# Altium schematic sheet PowerConverters.SchDoc
size A3; SheetNumber: 3; SheetTotal: 3
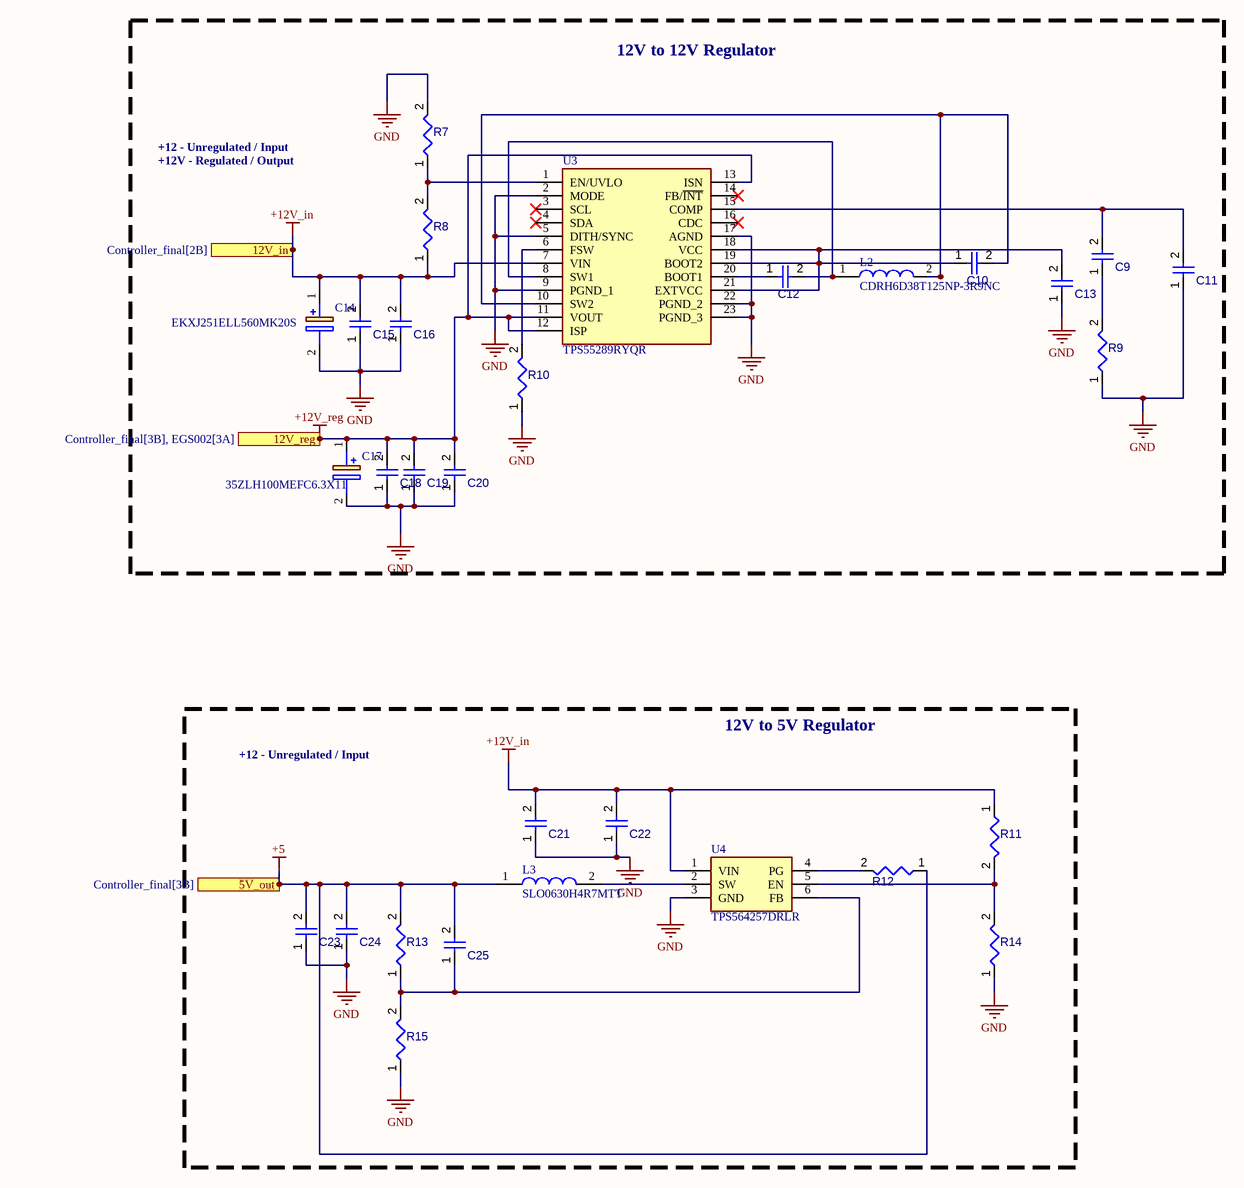
[diagram p0: PowerConverters.SchDoc]

## Parts
C9  Capacitor 1nF +/-20% 50V 0402  [CAPC0402(1005)33_L]  (value not drawn)
C10  Capacitor 100 nF +/-10% 50 V 0603  [CAPC1608X90X40NL10T20]  (value not drawn)
C11  Capacitor 1 uF +/- 10% 25 V 0805  [CAPC2013X145X50ML20T25]  (value not drawn)
C12  Capacitor 100 nF +/-10% 50 V 0603  [CAPC1608X90X40NL10T20]  (value not drawn)
C13  Capacitor 4.7µF +/-40% 25V 0805  [CAPC0805(2012)145_L]  (value not drawn)
C14  EKXJ251ELL560MK20S  [CAPPRD500W60D1275H2000 - duplicate]
C15  Capacitor 22µF +/-40% 16V 0805  [CAPC0805(2012)145_L]  (value not drawn)
C16  Capacitor 1µF +/-40% 50V 0603  [CAPC0603(1608)100_L]  (value not drawn)
C17  35ZLH100MEFC6.3X11  [CAPPRD250W50D680H1250]
C18  Capacitor 22µF +/-40% 16V 0805  [CAPC0805(2012)145_L]  (value not drawn)
C19  Capacitor 22µF +/-40% 16V 0805  [CAPC0805(2012)145_L]  (value not drawn)
C20  Capacitor 1µF +/-40% 50V 0603  [CAPC0603(1608)100_L]  (value not drawn)
C21  Capacitor 22µF +/-40% 16V 0805  [CAPC0805(2012)145_L]  (value not drawn)
C22  Capacitor 100 nF +/-10% 50 V 0603  [CAPC1608X90X40NL10T20]  (value not drawn)
C23  Capacitor 22µF +/-40% 16V 0805  [CAPC0805(2012)145_L]  (value not drawn)
C24  Capacitor 100 nF +/-10% 50 V 0603  [CAPC1608X90X40NL10T20]  (value not drawn)
C25  Capacitor 10 pF +/- 0.25 pF 50 V 0603  [CAPC1608X87X35NL15T15]  (value not drawn)
L2  CDRH6D38T125NP-3R9NC  [CDRH6D18HPNP101PC]
L3  SLO0630H4R7MTT  [INDPM7166X300N]
R7  Resistor 100k +/-1% 1206 250 mW  [RESC3216X60X45ML15T20]  (value not drawn)
R8  Resistor 100k +/-1% 0603 100 mW  [RESC1608X55X25ML10T15]  (value not drawn)
R9  Resistor 100k +/-1% 0603 100 mW  [RESC1608X55X25ML10T15]  (value not drawn)
R10  Resistor 100k +/-1% 1206 250 mW  [RESC3216X60X45ML15T20]  (value not drawn)
R11  210 kOhms 0805  [RESC0805(2012)_L]  (value not drawn)
R12  Resistor 10k +/-1% 0805 125 mW  [RESC2013X50X35ML15T15]  (value not drawn)
R13  Resistor 125mW 220kΩ 0805  [RESC2013X70X40ML20T20]  (value not drawn)
R14  Resistor 30k +/-1% 0805 125 mW  [RESC2013X50X35ML15T15]  (value not drawn)
R15  Resistor 30k +/-1% 0805 125 mW  [RESC2013X50X35ML15T15]  (value not drawn)
U3  TPS55289RYQR  [TPS55289RYQR]
U4  TPS564257DRLR  [SOTFL50P160X60-6N]

## Blocks framed on the sheet
12V to 12V Regulator: C9-C20 L2 R7-R10 U3
12V to 5V Regulator: C21-C25 L3 R11-R15 U4

## Ports
5V_out (see Controller_final[3B]), 12V_in (see Controller_final[2B]), 12V_reg (see Controller_final[3B], EGS002[3A])

## Nets
+5: C23.2 C24.2 C25.2 L3.1 R12.1 R13.2 ; port 5V_out
+12V_in: C14.1(+) C15.2 C16.2 C21.2 C22.2 R8.1 R11.1 U3.7(VIN) U4.1(VIN) ; port 12V_in
+12V_reg: C17.1(+) C18.2 C19.2 C20.2 U3.11(VOUT) U3.12(ISP) U3.13(ISN) ; port 12V_reg
GND: C11.1 C13.1 C14.2(-) C15.1 C16.1 C17.2(-) C18.1 C19.1 C20.1 C21.1 C22.1 C23.1 C24.1 R7.2 R9.1 R10.1 R14.1 R15.1 U3.2(MODE) U3.5(DITH/SYNC) U3.9(PGND_1) U3.17(AGND) U3.22(PGND_2) U3.23(PGND_3) U4.3(GND)
NetC9_1: C9.1 R9.2
NetC9_2: C9.2 C11.2 U3.15(COMP)
NetC10_1: C10.1 C13.2 U3.18(VCC) U3.19(BOOT2) U3.21(EXTVCC)
NetC10_2: C10.2 L2.2 U3.10(SW2)
NetC12_1: C12.1 U3.20(BOOT1)
NetC12_2: C12.2 L2.1 U3.8(SW1)
NetC25_1: C25.1 R13.1 R15.2 U4.6(FB)
NetL3_2: L3.2 U4.2(SW)
NetR7_1: R7.1 R8.2 U3.1(EN/UVLO)
NetR10_2: R10.2 U3.6(FSW)
NetR11_2: R11.2 R14.2 U4.5(EN)
NetR12_2: R12.2 U4.4(PG)

Not connected (* = marked no-connect by the designer): U3 3(SCL)* 4(SDA)* 14(FB/~{INT})* 16(CDC)*

## Notes on the sheet
- +12 - Unregulated / Input
- +12V - Regulated / Output

## Library data of the parts
C9 = CMP-001-00066-3: Chip Capacitor, 1nF +/-20%, 50V, 0402, Thickness 0.33 mm; Tolerance: 10%; Mounting Technology: SMT; Case/Package: 0402; Pins: 2; Min Operating Temperature: -55°C; Max Operating Temperature: 85°C; Voltage Rating: 50V; Value: 1nF
C10 C12 C22 C24 = CMP-001-00017-6: Chip Capacitor, 100 nF, +/- 10%, 50 V, 0603 (1608 Metric); Capacitor Type: Ceramic; Voltage Rating: 50V; Value: 100nF; Mounting Technology: SM; Case/Package: 0603; Pins: 2; RoHS Compliant: True; Min Operating Temperature: -55°C; Max Operating Temperature: 125°C; Tolerance: 10%
C11 = CMP-001-00010-6: Chip Capacitor, 5.1pF, +/-10%, 250 V, 0805 (2012 Metric); Capacitor Type: Ceramic; Voltage Rating: 25V; Value: 1µF; Mounting Technology: SM; Case/Package: 0805; Pins: 2; RoHS Compliant: True; Min Operating Temperature: -55°C; Max Operating Temperature: 125°C; Tolerance: 10%
C13 = CMP-001-00080-4: Chip Capacitor, 4.7µF +/-40%, 25V, 0805, Thickness 1.45 mm; Tolerance: 20%; Mounting Technology: SMT; Case/Package: 0805; Pins: 2; Min Operating Temperature: -55°C; Max Operating Temperature: 85°C; Voltage Rating: 25V; Value: 4.7µF
C14 = UPW0J222MHD: 56uF 250V Aluminum Electrolytic Capacitors Through Hole,D12.5xL20mm 10000hrs@105℃; Manufacturer_Name: Nichicon; Datasheet Link: https://componentsearchengine.com/Datasheets/1/UPW0J222MHD.pdf; Height: 20mm; Manufacturer_Part_Number: UPW0J222MHD; Mouser Part Number: 647-UPW0J222MHD; Mouser Price/Stock: https://www.mouser.co.uk/ProductDetail/Nichicon/UPW0J222MHD?qs=xKlMw8j03VdQkAIq%2FPYnUg%3D%3D
C15 C18 C19 C21 C23 = CMP-001-00081-4: Chip Capacitor, 22µF +/-20%, 25V, 0805, Thickness 1.45 mm X5R; Tolerance: 5%; Mounting Technology: SMT; Case/Package: 0805; Pins: 2; Min Operating Temperature: -55°C; Max Operating Temperature: 85°C; Voltage Rating: 16V; Value: 22µF
C16 C20 = CMP-001-00078-4: Chip Capacitor, 1µF +/-40%, 50V, 0603, Thickness 1 mm; Tolerance: 10%; Mounting Technology: SMT; Case/Package: 0603; Pins: 2; Min Operating Temperature: -55°C; Max Operating Temperature: 85°C; Voltage Rating: 50V; Value: 1µF
C17 = MAL203856101E3: 100uF 35V Aluminum Electrolytic Capacitors Through Hole,D6.3xL11mm 6000hrs@105℃; Manufacturer_Name: Vishay; Datasheet Link: https://componentsearchengine.com/Datasheets/2/MAL203856101E3.pdf; Height: 12.5mm; Manufacturer_Part_Number: MAL203856101E3; Mouser Part Number: 594-MAL203856101E3; Mouser Price/Stock: https://www.mouser.co.uk/ProductDetail/Vishay-BC-Components/MAL203856101E3?qs=G99oyVYclWUG3wiHKtPKfA%3D%3D; Arrow Part Number: MAL203856101E3; Arrow Price/Stock: https://www.arrow.com/en/products/mal203856101e3/vishay
C25 = CMP-001-00012-6: Chip Capacitor, 10 pF, +/- 0.25 pF, 50 V, 0603 (1608 Metric); Capacitor Type: Ceramic; Voltage Rating: 50V; Tolerance: 0.25%; Value: 10pF; Mounting Technology: SM; Case/Package: 0603; Pins: 2; RoHS Compliant: True; Min Operating Temperature: -55°C; Max Operating Temperature: 125°C
L2 = CDRH6D18HPNP-101PC: Inductor 3.9uH ,19.6mOhm, SMD, 6.7mm X 6.7mm; Manufacturer_Name: Sumida; Datasheet Link: https://4donline.ihs.com/images/VipMasterIC/IC/SMDC/SMDC-S-A0002849326/SMDC-S-A0002849326-1.pdf?hkey=EF798316E3902B6ED9A73243A3159BB0; Height: 2mm; Manufacturer_Part_Number: CDRH6D18HPNP-101PC
L3 = SRP6530A-R47M: 5.5A 4.7uH ±20% 9A 38mΩ Magnetic Shielded Inductor SMD,7.1x6.6mm Fixed Inductors RoHS; Manufacturer_Name: Bourns; Datasheet Link: http://www.bourns.com/docs/Product-Datasheets/SRP6530A.pdf; Height: 3mm; Manufacturer_Part_Number: SRP6530A-R47M; Mouser Part Number: 652-SRP6530A-R47M; Mouser Price/Stock: https://www.mouser.co.uk/ProductDetail/Bourns/SRP6530A-R47M?qs=e8oIoAS2J1QHe7BXX3%252BHFQ%3D%3D; Arrow Part Number: SRP6530A-R47M; Arrow Price/Stock: https://www.arrow.com/en/products/srp6530a-r47m/bourns?region=nac
R7 = CMP-009-00025-5: Chip Resistor, 100 KOhm, +/- 1%, 0.25 W, -55 to 155 degC, 1206 (3216 Metric); Power: 250mW; Voltage Rating: 200V; Mounting Technology: SM; Case/Package: 1206; Pins: 2; RoHS Compliant: True; Min Operating Temperature: -55°C; Max Operating Temperature: 155°C; Tolerance: 1%; Value: 100k
R8 = CMP-009-00023-5: Chip Resistor, 715 KOhm, +/- 1%, 0.1 W, -55 to 155 degC, 0603 (1608 Metric); Power: 100mW; Voltage Rating: 50V; Mounting Technology: SM; Case/Package: 0603; Pins: 2; RoHS Compliant: True; Min Operating Temperature: -55°C; Max Operating Temperature: 155°C; Tolerance: 1%; Value: 100k
R9 = CMP-009-00023-5: Chip Resistor, 105 KOhm, +/- 1%, 0.1 W, -55 to 155 degC, 0603 (1608 Metric); Power: 100mW; Voltage Rating: 50V; Mounting Technology: SM; Case/Package: 0603; Pins: 2; RoHS Compliant: True; Min Operating Temperature: -55°C; Max Operating Temperature: 155°C; Tolerance: 1%; Value: 100k
R10 = CMP-009-00025-5: Chip Resistor, 48.7 KOhm, +/- 1%, 0.25 W, -55 to 155 degC, 200V, 1206 (3216 Metric); Power: 250mW; Mounting Technology: SM; Case/Package: 1206; Pins: 2; RoHS Compliant: True; Min Operating Temperature: -55°C; Max Operating Temperature: 155°C; Tolerance: 1%; Voltage Rating: 200V; Value: 100k
R11 = CMP-009-00076-2: 210kΩ ±1% 125mW 0805 Thick Film Resistor; Tolerance: 5%; Value: 1k; Mounting Technology: SMT; Case/Package: 0805; Pins: 2; Power: 125mW
R12 = CMP-009-00018-5: Chip Resistor, 10 KOhm, +/- 1%, 125 mW, -55 to 155 degC, 0805 (2012 Metric); Power: 125mW; Voltage Rating: 150V; Mounting Technology: SM; Case/Package: 0805; Pins: 2; RoHS Compliant: True; Min Operating Temperature: -55°C; Max Operating Temperature: 155°C; Tolerance: 1%; Value: 10k
R13 = CMP-009-00024-5: 125mW 220kΩ 150V Thick Film Resistor ±100ppm/℃ ±1% 0805 Chip Resistor - Surface Mount RoHS; Value: 100k; Mounting Technology: SM; Case/Package: 0805; Pins: 2; RoHS Compliant: True; Min Operating Temperature: -55°C; Max Operating Temperature: 155°C; Tolerance: 1%; Power: 125mW; Voltage Rating: 150V
R14 R15 = CMP-009-00018-5: 30kΩ ±1% 125mW 0805 Thick Film Resistor; Voltage Rating: 150V; Value: 10k; Mounting Technology: SM; Case/Package: 0805; Pins: 2; RoHS Compliant: True; Min Operating Temperature: -55°C; Max Operating Temperature: 155°C; Tolerance: 1%; Power: 125mW
U3 = TPS55289RYQR: Integrated Circuit; Manufacturer_Name: Texas Instruments; Datasheet Link: https://www.ti.com/lit/ds/symlink/tps55289.pdf?ts=1664818706180&ref_url=https%253A%252F%252Fwww.ti.com%252Fproduct%252FTPS55289%252Fpart-details%252FTPS55289RYQR%253FkeyMatch%253DTPS55289RYQR; Height: 1mm; Manufacturer_Part_Number: TPS55289RYQR; Mouser Part Number: 595-TPS55289RYQR; Mouser Price/Stock: https://www.mouser.co.uk/ProductDetail/Texas-Instruments/TPS55289RYQR?qs=T%252BzbugeAwjhgaIN94Lbpjg%3D%3D; Arrow Part Number: TPS55289RYQR; Arrow Price/Stock: https://www.arrow.com/en/products/tps55289ryqr/texas-instruments.html?utm_currency=USD&region=nac
U4 = TPS564257DRLR: Integrated Circuit; Manufacturer_Name: Texas Instruments; Datasheet Link: https://www.ti.com/lit/ds/symlink/tps564257.pdf?HQS=dis-mous-null-mousermode-dsf-pf-null-wwe&ts=1695023870951&ref_url=https%253A%252F%252Fwww.mouser.de%252F; Height: 0.6mm; Manufacturer_Part_Number: TPS564257DRLR; Mouser Part Number: 595-TPS564257DRLR; Mouser Price/Stock: https://www.mouser.co.uk/ProductDetail/Texas-Instruments/TPS564257DRLR?qs=ulEaXIWI0c8amaZvnJWTQQ%3D%3D; Arrow Part Number: TPS564257DRLR; Arrow Price/Stock: https://www.arrow.com/en/products/tps564257drlr/texas-instruments?utm_currency=USD&region=nac